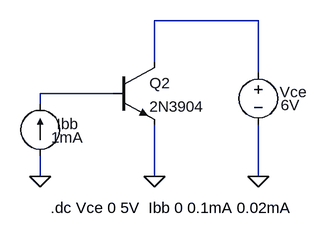
[diagram p0: schematic ce-output.asc]
ce-output.asc, the LTspice schematic file:
Version 4
SHEET 1 880 680
WIRE 368 16 208 16
WIRE 208 80 208 16
WIRE 368 96 368 16
WIRE 144 128 32 128
WIRE 32 144 32 128
WIRE 32 256 32 224
WIRE 208 256 208 176
WIRE 368 256 368 176
FLAG 208 256 0
FLAG 32 256 0
FLAG 368 256 0
SYMBOL voltage 368 80 R0
WINDOW 3 35 66 Left 2
WINDOW 123 0 0 Left 2
WINDOW 39 0 0 Left 2
WINDOW 0 33 46 Left 2
SYMATTR Value 6V
SYMATTR InstName Vce
SYMBOL npn 144 80 R0
SYMATTR InstName Q2
SYMATTR Value 2N3904
SYMBOL current 32 224 R180
WINDOW 0 -59 49 Left 2
WINDOW 3 -66 28 Left 2
WINDOW 123 0 0 Left 2
WINDOW 39 0 0 Left 2
SYMATTR InstName Ibb
SYMATTR Value 1mA
TEXT 48 304 Left 2 !.dc Vce 0 5V  Ibb 0 0.1mA 0.02mA

The netlist it stands for:
* ce-output.asc
Vce N001 0 6V
Q2 N001 N002 0 0 2N3904
Ibb 0 N002 1mA
.model NPN NPN
.model PNP PNP
.lib standard.bjt
.dc Vce 0 5V  Ibb 0 0.1mA 0.02mA
.backanno
.end